# Altium schematic sheet Shem_1.SchDoc
size A4; SheetNumber: 1; SheetTotal: 1
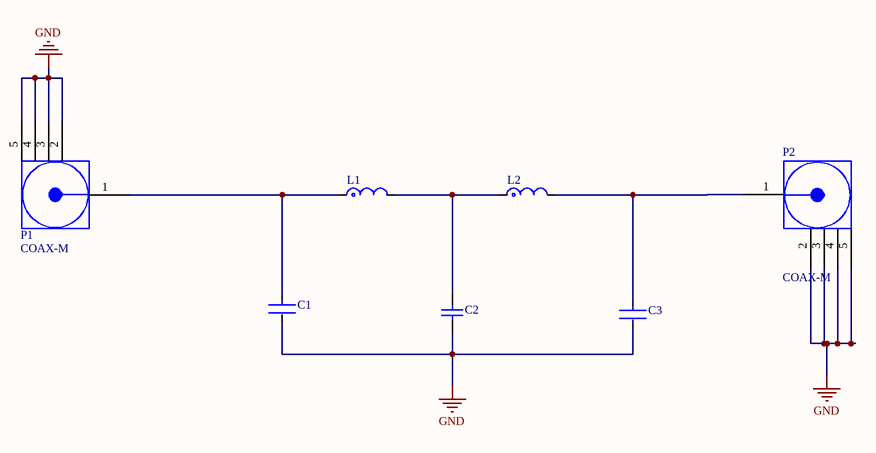
[diagram p0: Shem_1.SchDoc]

## Parts
C1  C0603C180F5GACTU  [FP-C0603C-CF-MFG]  (value not drawn)
C2  C0402T330J3GACTU  [CAPC1005X55X30ML05T10]  (value not drawn)
C3  C0603C180F5GACTU  [FP-C0603C-CF-MFG]  (value not drawn)
L1  LQG15WZ62NG02D  [FP-LQG15HH_02-MFG]  (value not drawn)
L2  LQG15WZ62NG02D  [FP-LQG15HH_02-MFG]  (value not drawn)
P1  COAX-M  [COAX-M]
P2  COAX-M  [COAX-M]

## Nets
GND: C1.2 C2.1 C3.2 P1.2 P1.3 P1.4 P1.5 P2.2 P2.3 P2.4 P2.5
NetC1_1: C1.1 L1.1 P1.1
NetC2_2: C2.2 L1.2 L2.1
NetC3_1: C3.1 L2.2 P2.1

## Library data of the parts
C1 C3 = CMP-03020-028712-1: C0603 18 pF C0G 30ppm/°C 1.00% 50 V; Manufacturer: KEMET; Value: 18 pF; Tolerance: 0.01; Automotive Grade: Grade 1; Material: Ceramic; Voltage Rating: 50 V; ComponentLink2URL: https://api.kemet.com/component-edge/download/datasheet/C0603C100J5GACAUTO.pdf; Temperature Characteristic: C0G; Capacitance: 18 pF; Package: C0603C-CF; Device Class L1: Passive Components; Octopart: https://octopart.com/c0603c180f5gactu-kemet-47052343; Manufacturer Part Number: C0603C180F5GACTU; Category: Cap; Device Class L3: Ceramic Capacitors; Lead Free: Yes; Temperature Coefficient: 30ppm/°C; ComponentLink2Description: Datasheet; Automotive: Yes; Temperature Range Low: -55°C; Device Class L2: Capacitors; Temperature Range High: +125°C; Mouser Description: Multilayer Ceramic Capacitors MLCC - SMD/SMT 50volts 18pF 1% C0G; Height: 0.87mm; Temperature: -55°C to +125°C; RoHS: TRUE
C2 = CMP-2008-03465-1: ±5% 25V Ceramic Capacitor C0G, / 33 pF, NP0 0402 (1005 Metric); Manufacturer: Kemet; Vaule: 33pF; Part Number: C0402T330J3GACTU
L1 L2 = CMP-06042-001578-1: Fixed Inductors 0402 62nH 2% 180mA 1.9ohm AEC-Q200; Max DC Current: 300mA; Inductance Tolerance: 5%; Self Resonant Frequency: 2.8GHz; Test Frequency: 100MHz; Inductance: 12nH; Core Material: Air; DC Resistance (DCR): 410mR; Q Factor: 8; Shielding: Unshielded; Mount: Surface Mount; Case/Package: 0402; Packaging: Cut Tape; Current Rating: 300mA; Case Code (Metric): 1005; Length: 0.039inch; Package Quantity: 10000; Depth: 0.55mm; Min Operating Temperature: -55°C; Case Code (Imperial): 0402; Max Operating Temperature: 125°C; Radiation Hardening: No; Height: 0.02inch; Lead Free: Lead Free; Tolerance: 5%; Military Standard: Not; DC Current: 300mA; Width: 0.02inch; Termination: SMD/SMT; REACH SVHC: No SVHC; Height - Seated (Max): 0.022inch